# EAGLE design project_2_DDR (EAGLE 9.6.2)
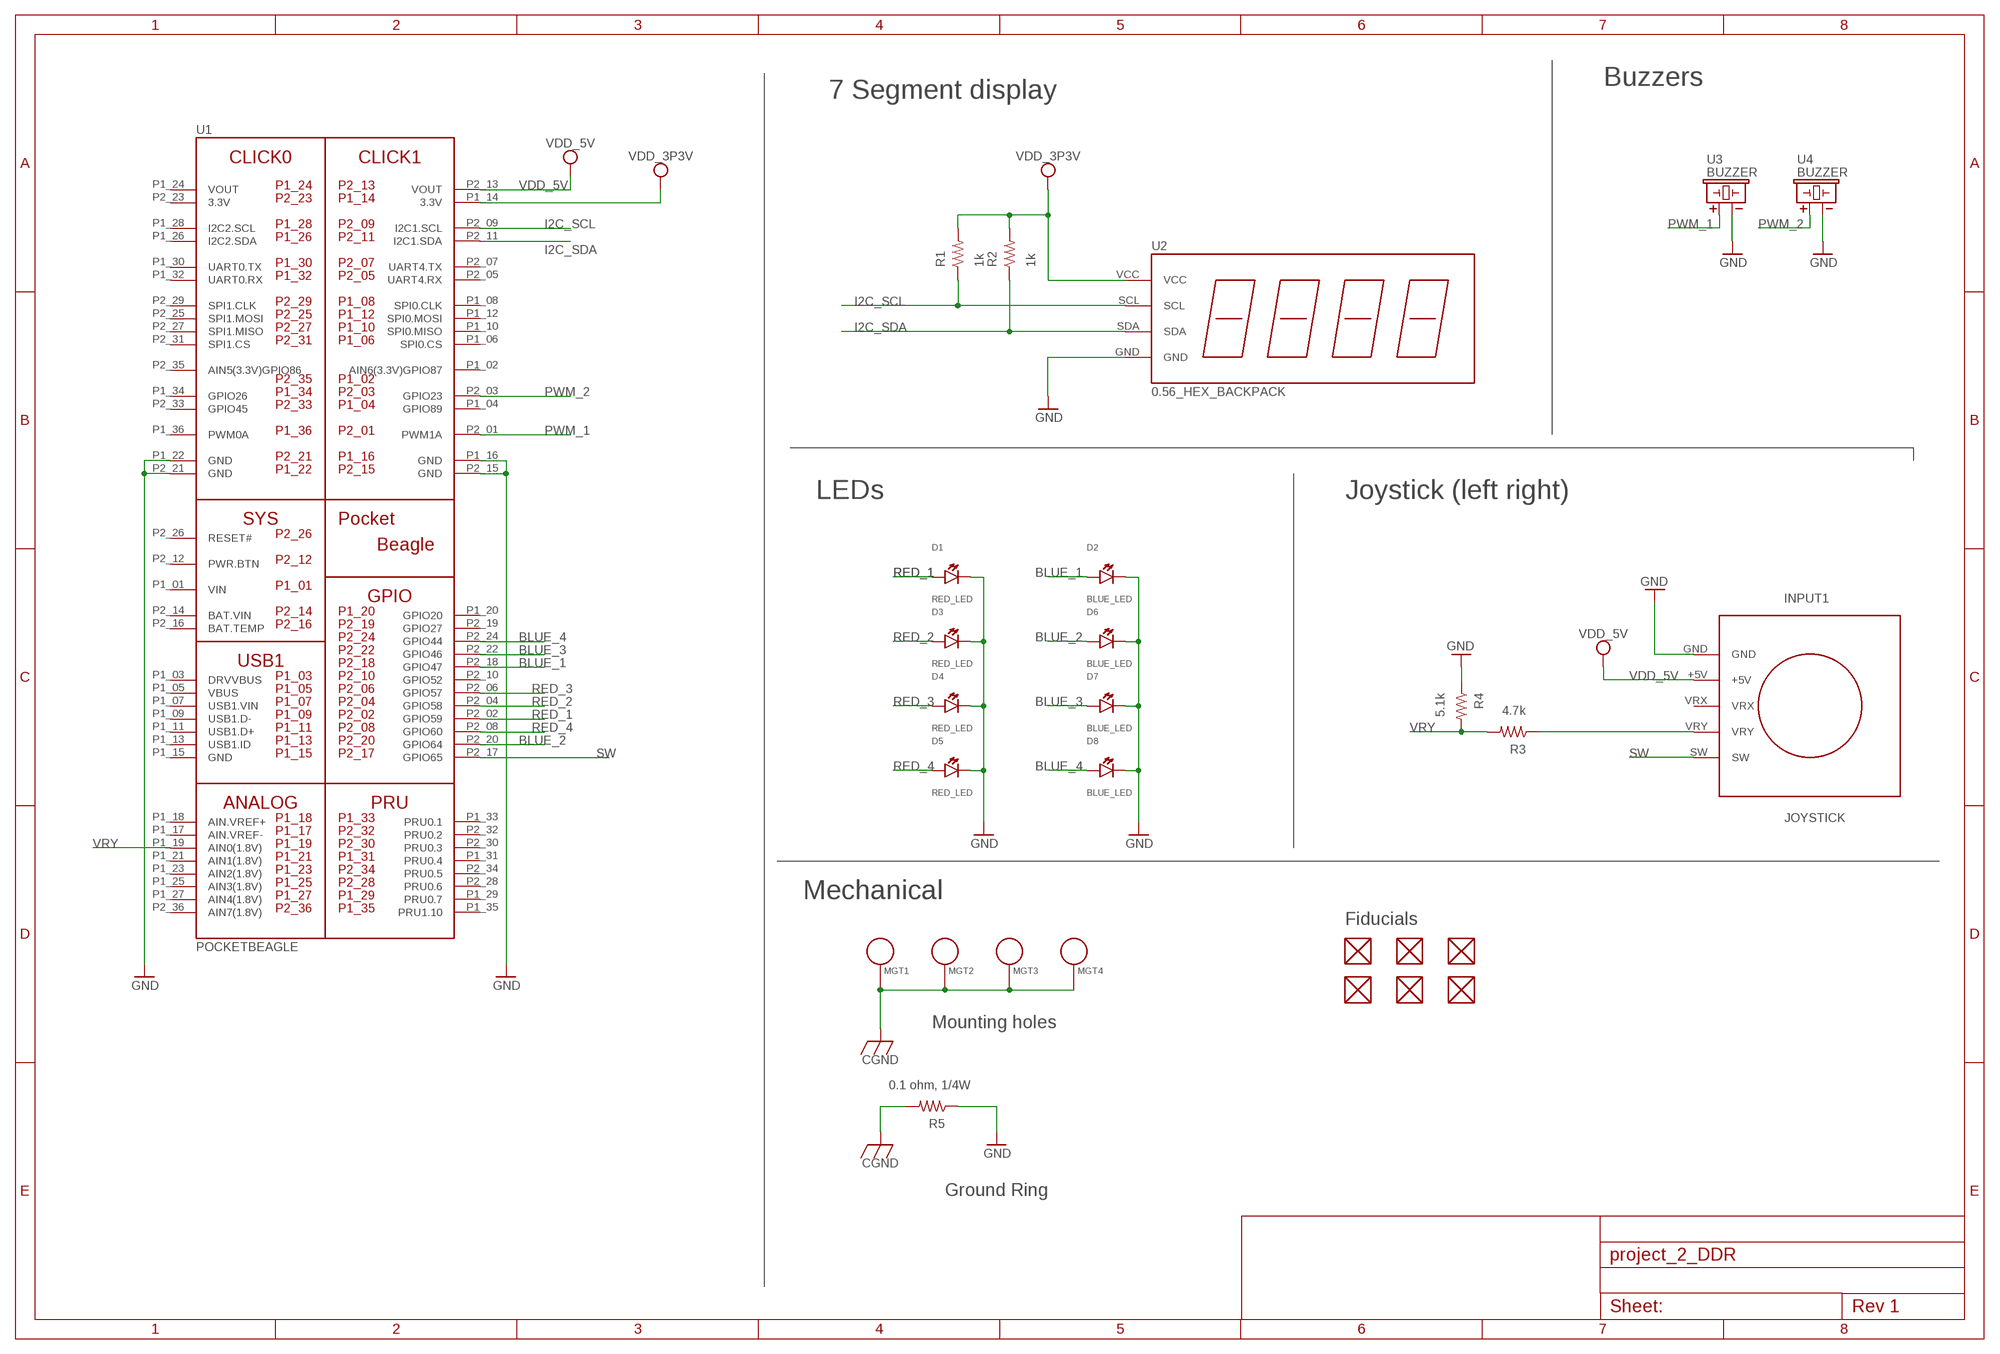
[diagram p0: schematic, sheet 1]

## Parts
D1  RED_LED  LED  [EIA-STD]
D2  BLUE_LED  LED  [EIA-STD]
D3  RED_LED  LED  [EIA-STD]
D4  RED_LED  LED  [EIA-STD]
D5  RED_LED  LED  [EIA-STD]
D6  BLUE_LED  LED  [EIA-STD]
D7  BLUE_LED  LED  [EIA-STD]
D8  BLUE_LED  LED  [EIA-STD]
FUD1  FIDUCIAL  [FIDUCIAL_40MIL]
FUD2  FIDUCIAL  [FIDUCIAL_40MIL]
FUD3  FIDUCIAL  [FIDUCIAL_40MIL]
FUD4  FIDUCIAL  [FIDUCIAL_40MIL]
FUD5  FIDUCIAL  [FIDUCIAL_40MIL]
FUD6  FIDUCIAL  [FIDUCIAL_40MIL]
INPUT1  JOYSTICK  [JOYSTICK]
MGT1  MOUNTING_HOLE  [MOUNTING_HOLE]
MGT2  MOUNTING_HOLE  [MOUNTING_HOLE]
MGT3  MOUNTING_HOLE  [MOUNTING_HOLE]
MGT4  MOUNTING_HOLE  [MOUNTING_HOLE]
R1  1k  R_R0603  [R0603]
R2  1k  R_R0603  [R0603]
R3  4.7k  R_R0603  [R0603]
R4  5.1k  R_R0603  [R0603]
R5  0.1 ohm, 1/4W  R_R0603  [R0603]
U1  POCKETBEAGLE  [POCKETBEAGLE]
U2  0.56_HEX_BACKPACK  [0.56_HEX_BACKPACK]
U3  BUZZER  [BUZZER_6.5MM]
U4  BUZZER  [BUZZER_6.5MM]

## Nets
BLUE_1: D2.ANODE U1.P2_18(GPIO47)
BLUE_2: D6.ANODE U1.P2_20(GPIO64)
BLUE_3: D7.ANODE U1.P2_22(GPIO46)
BLUE_4: D8.ANODE U1.P2_24(GPIO44)
CGND: MGT1.P$1 MGT2.P$1 MGT3.P$1 MGT4.P$1 R5.2
GND: D1.CATHODE D2.CATHODE D3.CATHODE D4.CATHODE D5.CATHODE D6.CATHODE D7.CATHODE D8.CATHODE INPUT1.GND R4.1 R5.1 U1.P1_16(GND) U1.P1_22(GND) U1.P2_15(GND) U1.P2_21(GND) U2.GND U3.- U4.-
I2C_SCL: R1.1 U1.P2_09(I2C1.SCL) U2.SCL
I2C_SDA: R2.1 U1.P2_11(I2C1.SDA) U2.SDA
N$1: INPUT1.VRY R3.1
PWM_1: U1.P2_01(PWM1A) U3.+
PWM_2: U1.P2_03(GPIO23) U4.+
RED_1: D1.ANODE U1.P2_02(GPIO59)
RED_2: D3.ANODE U1.P2_04(GPIO58)
RED_3: D4.ANODE U1.P2_06(GPIO57)
RED_4: D5.ANODE U1.P2_08(GPIO60)
SW: INPUT1.SW U1.P2_17(GPIO65)
VDD_3P3V: R1.2 R2.2 U1.P1_14(3.3V) U2.VCC
VDD_5V: INPUT1.+5V U1.P2_13(VOUT)
VRY: R3.2 R4.2 U1.P1_19(AIN0(1.8V))
Unconnected: FUD1.P$1 FUD2.P$1 FUD3.P$1 FUD4.P$1 FUD5.P$1 FUD6.P$1 INPUT1.VRX U1.P1_02(AIN6(3.3V)GPIO87) U1.P1_03(DRVVBUS) U1.P1_04(GPIO89) U1.P1_05(VBUS) U1.P1_06(SPI0.CS) U1.P1_07(USB1.VIN) U1.P1_08(SPI0.CLK) U1.P1_09(USB1.D-) U1.P1_10(SPI0.MISO) U1.P1_11(USB1.D+) U1.P1_12(SPI0.MOSI) U1.P1_13(USB1.ID) U1.P1_15(GND) U1.P1_17(AIN.VREF-) U1.P1_18(AIN.VREF+) U1.P1_20(GPIO20) U1.P1_21(AIN1(1.8V)) U1.P1_23(AIN2(1.8V)) U1.P1_25(AIN3(1.8V)) U1.P1_26(I2C2.SDA) U1.P1_27(AIN4(1.8V)) U1.P1_28(I2C2.SCL) U1.P1_29(PRU0.7) U1.P1_30(UART0.TX) U1.P1_31(PRU0.4) U1.P1_32(UART0.RX) U1.P1_33(PRU0.1) U1.P1_34(GPIO26) U1.P1_35(PRU1.10) U1.P1_36(PWM0A) U1.P2_05(UART4.RX) U1.P2_07(UART4.TX) U1.P2_10(GPIO52) U1.P2_12(PWR.BTN) U1.P2_16(BAT.TEMP) U1.P2_19(GPIO27) U1.P2_25(SPI1.MOSI) U1.P2_26(RESET#) U1.P2_27(SPI1.MISO) U1.P2_28(PRU0.6) U1.P2_29(SPI1.CLK) U1.P2_30(PRU0.3) U1.P2_31(SPI1.CS) U1.P2_32(PRU0.2) U1.P2_33(GPIO45) U1.P2_34(PRU0.5) U1.P2_35(AIN5(3.3V)GPIO86) U1.P2_36(AIN7(1.8V))

## Notes on the sheet
- Buzzers
- 7 Segment display
- LEDs | Joystick (left right)
- Mechanical
- Fiducials
- Mounting holes
- Ground Ring

## Power pins joined to a net without a drawn wire
3.3V: U1.P2_23(3.3V)
BAT.VIN: U1.P2_14(BAT.VIN)
VIN: U1.P1_01(VIN)
VOUT: U1.P1_24(VOUT)

## Library data of the parts
D1-D8 = combo_lock:LED: EIA-STD LED, LTST-C191TBKT
FUD1-FUD6 = combo_lock:FIDUCIAL
INPUT1 = MISC:JOYSTICK
MGT1-MGT4 = combo_lock:MOUNTING_HOLE: Chassis Mounting Hole w/GND connection ability
R1-R5 = combo_lock:R_: RESISTOR, American symbol
U1 = combo_lock:POCKETBEAGLE
U2 = combo_lock:0.56_HEX_BACKPACK: 0.56" LED HEX Backback - Adafruit HT16K33 - https://www.adafruit.com/product/878 - https://www.adafruit.com/product/879 - https://www.adafruit.com/product/880 - https://www.adafruit.com/product/881 - https://www.adafruit.com/product/1002
U3 U4 = combo_lock:BUZZER: CEM-1203 Buzzer

## Board
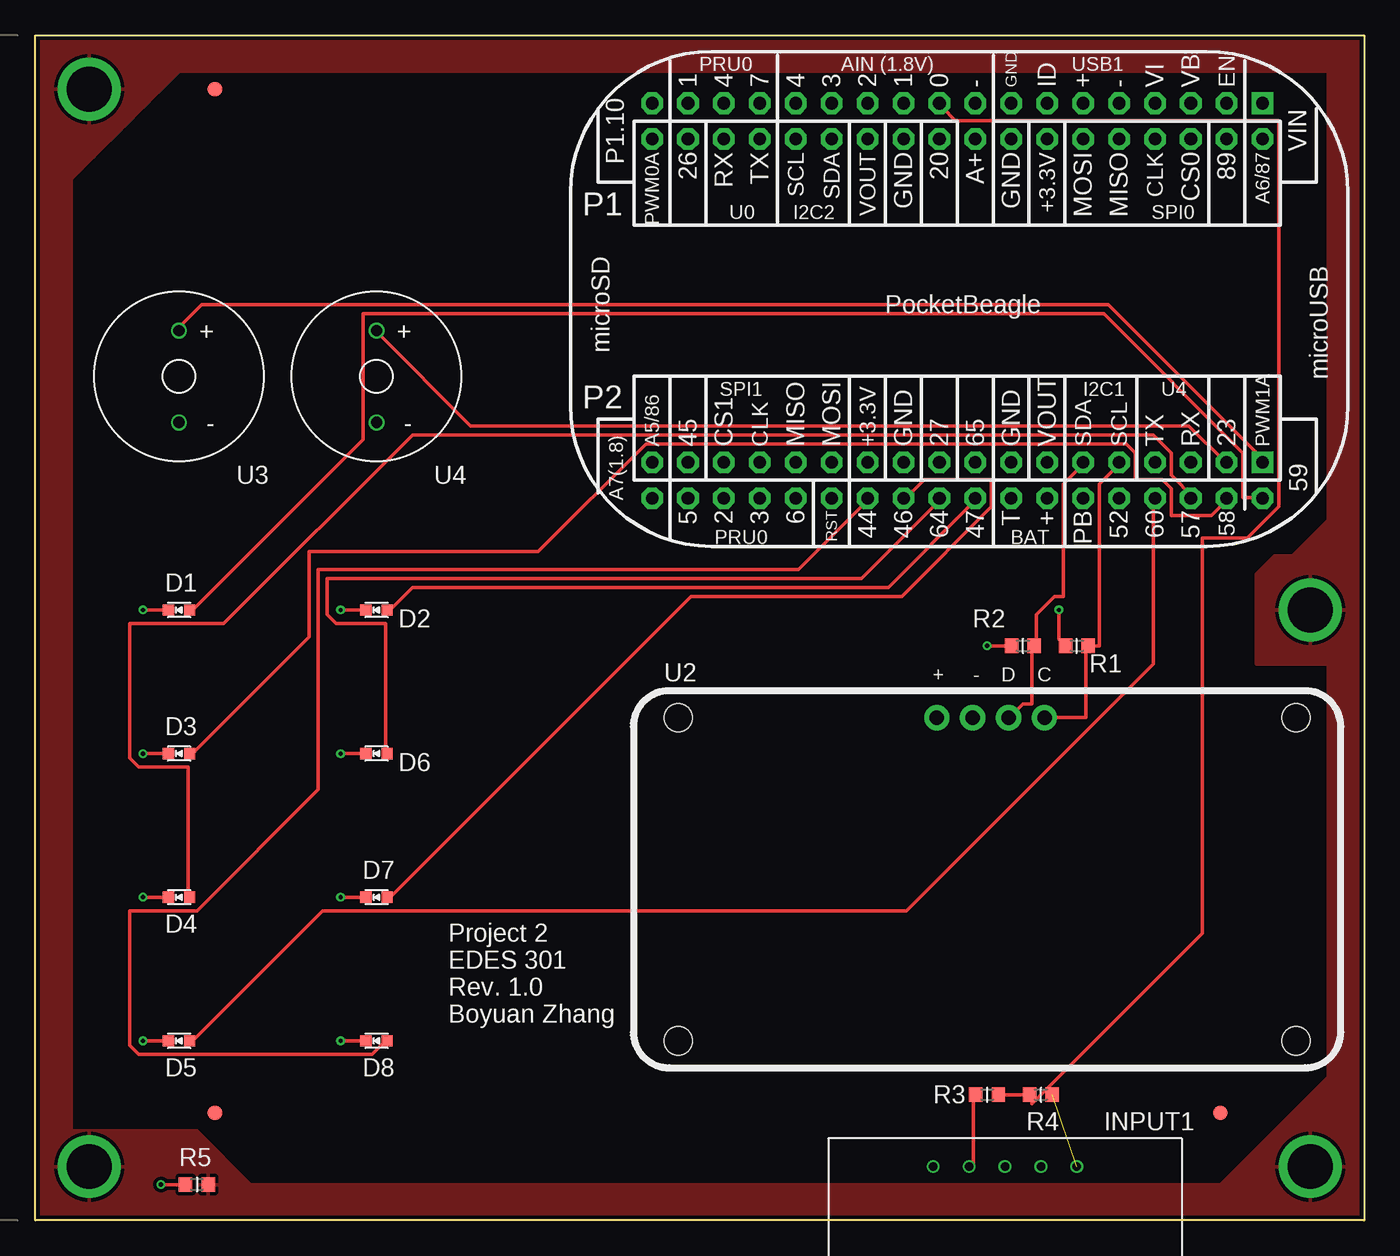
[diagram p1: board, top side]
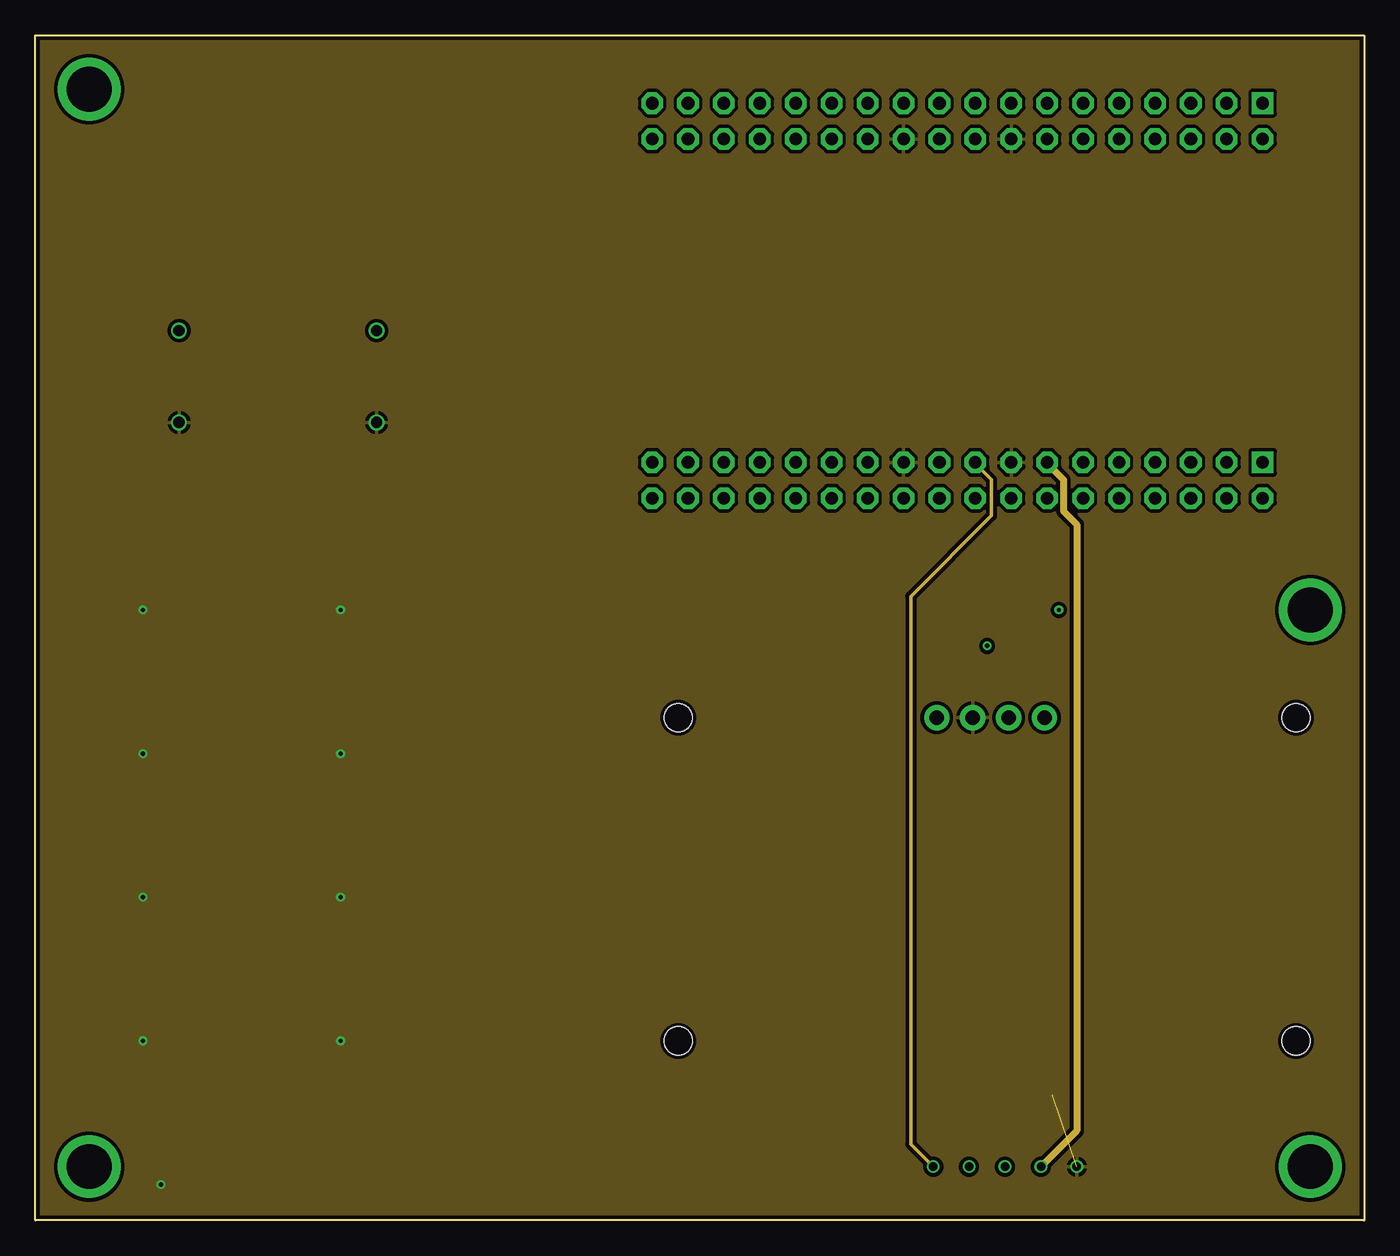
[diagram p2: board, inner layer Route2]
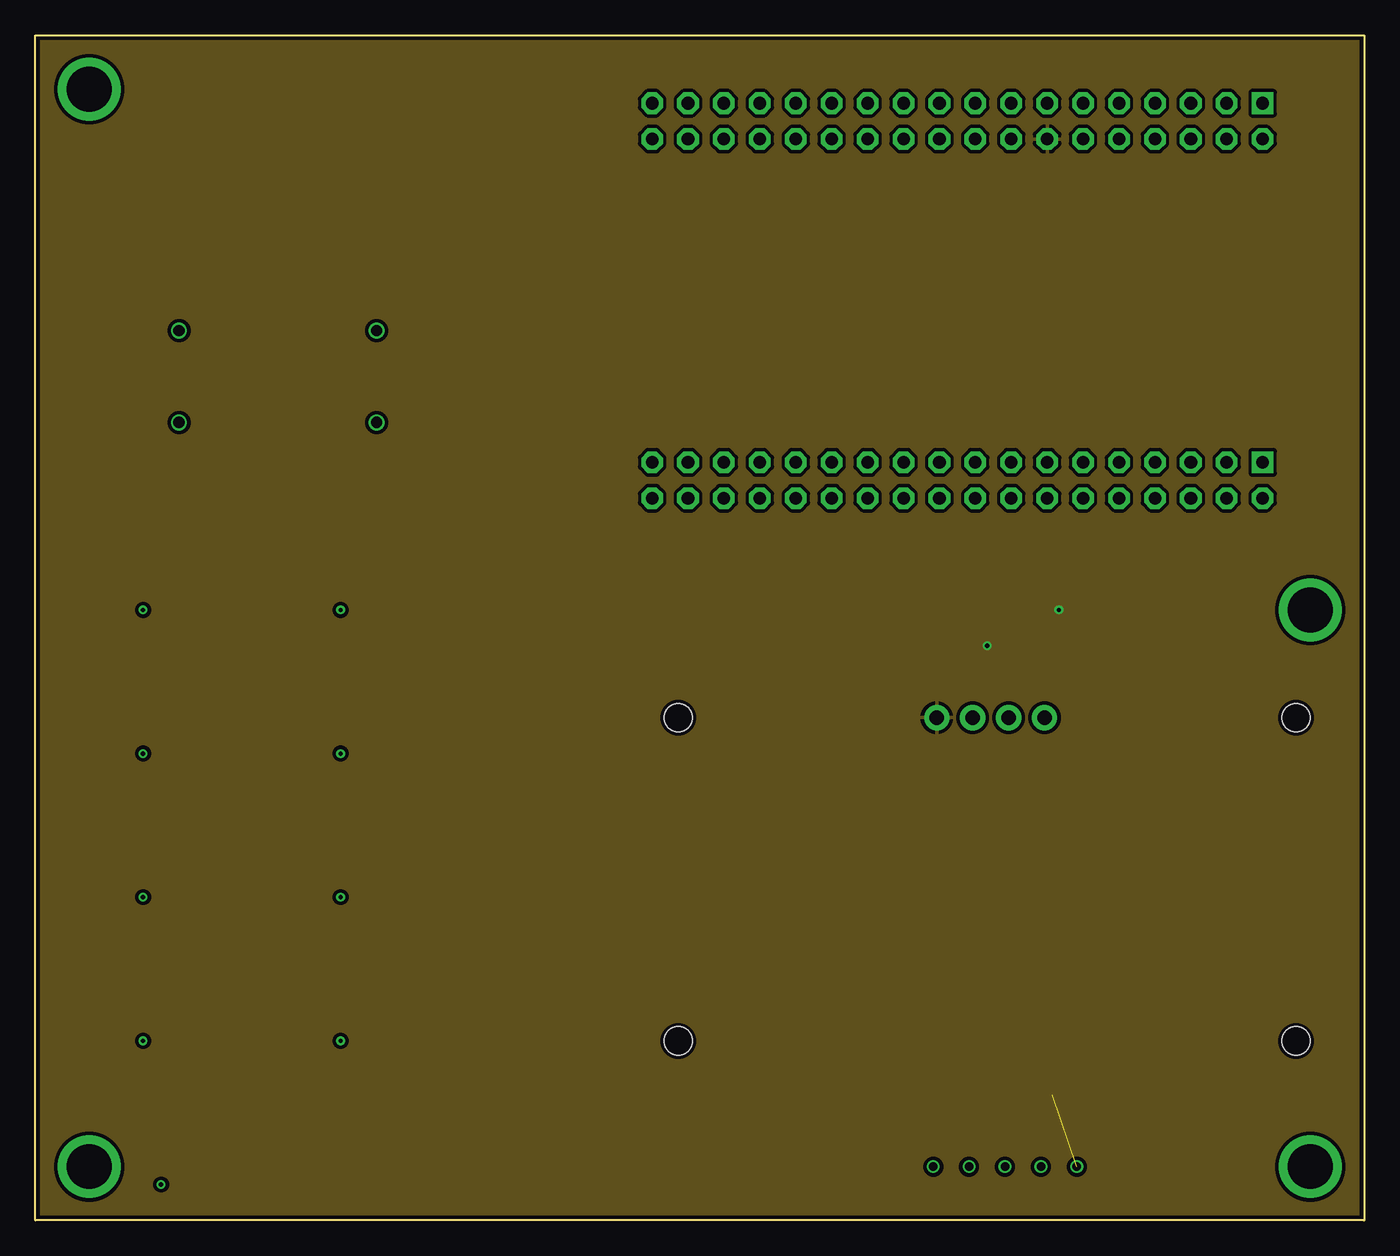
[diagram p3: board, inner layer Route15]
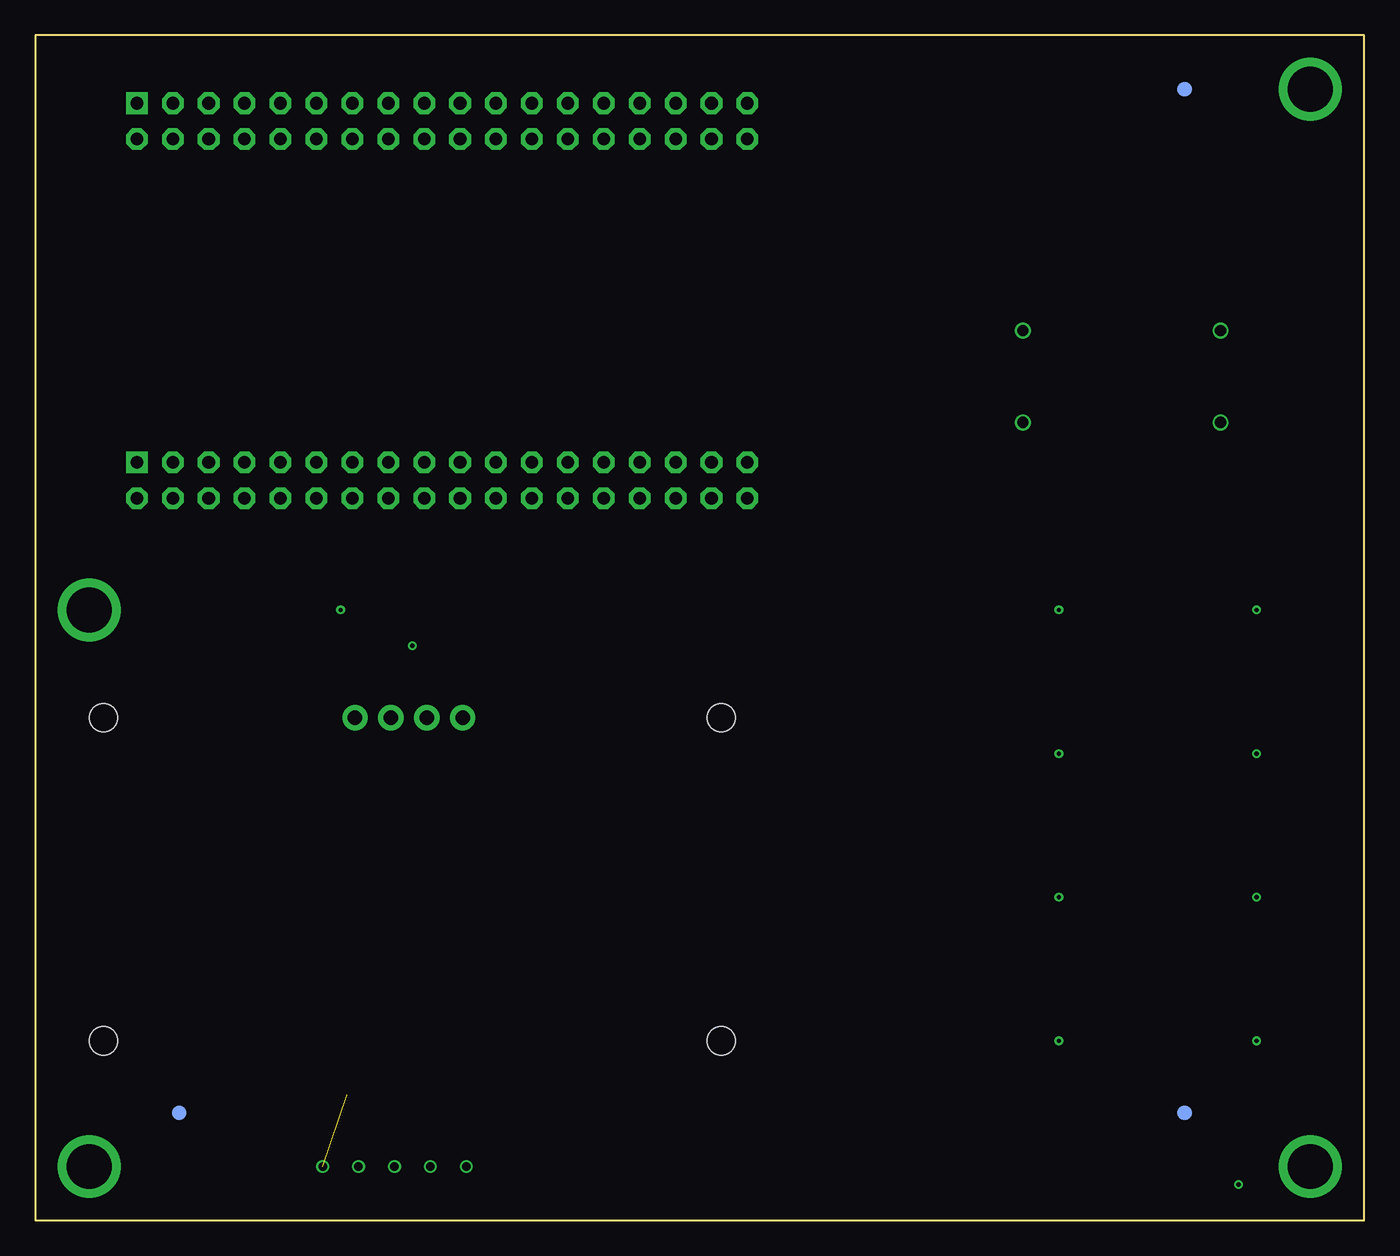
[diagram p4: board, bottom side, seen from below]

Size 93.98 x 83.82 mm. Coordinates in mm from the lower left corner, seen from the top.
Outline: 0,0 0,83.82 93.98,83.82 93.98,0 0,0
Copper layers (1*2*15*16): Top 0.035mm / dielectric 0.23mm / Route2 0.035mm / dielectric 0.93mm / Route15 0.035mm / dielectric 0.23mm / Bottom 0.035mm
Design rules "EDES301_4lyr": minimum track width 10mil, minimum drill 12mil, track to track 10mil, track to pad 10mil, pad to pad 10mil, via to via 10mil, smd to smd 10mil, copper to edge 10mil, drill to drill 12mil, minimum pad ring 6mil, minimum via ring 6mil, stop-mask expansion 3mil, vias tented up to drill 25mil, thermal gap 10mil

### Footprints (pad centres in the part's own frame; a part is rotated, then mirrored left to right if it is on the bottom)
EIA-STD = smd 0.8 x 0.8: ANODE -0.75,0; CATHODE 0.75,0
FIDUCIAL_40MIL = smd 1.016 x 1.016: P$1 0,0
JOYSTICK = drill 0.6: +5V -16.51,2.54; GND -16.51,5.08; SW -16.51,-5.08; VRX -16.51,0; VRY -16.51,-2.54
MOUNTING_HOLE = drill 3.175 pad 4.445: P$1 0,0
R0603 = smd 0.95 x 1.031: 1 -0.8,0; 2 0.8,0
POCKETBEAGLE = drill 0.889 pad 1.524 square: P1_01 5.91,3.53; P2_01 5.91,28.93 | drill 0.889 pad 1.524 octagon: P1_02 5.91,6.07; P1_03 8.45,3.53; P1_04 8.45,6.07; P1_05 10.99,3.53; P1_06 10.99,6.07; P1_07 13.53,3.53; P1_08 13.53,6.07; P1_09 16.07,3.53; P1_10 16.07,6.07; P1_11 18.61,3.53; P1_12 18.61,6.07; P1_13 21.15,3.53; P1_14 21.15,6.07; P1_15 23.69,3.53; P1_16 23.69,6.07; P1_17 26.23,3.53; P1_18 26.23,6.07; P1_19 28.77,3.53; P1_20 28.77,6.07; P1_21 31.31,3.53; P1_22 31.31,6.07; P1_23 33.85,3.53; P1_24 33.85,6.07; P1_25 36.39,3.53; P1_26 36.39,6.07; P1_27 38.93,3.53; P1_28 38.93,6.07; P1_29 41.47,3.53; P1_30 41.47,6.07; P1_31 44.01,3.53; P1_32 44.01,6.07; P1_33 46.55,3.53; P1_34 46.55,6.07; P1_35 49.09,3.53; P1_36 49.09,6.07; P2_02 5.91,31.47; P2_03 8.45,28.93; P2_04 8.45,31.47; P2_05 10.99,28.93; P2_06 10.99,31.47; P2_07 13.53,28.93; P2_08 13.53,31.47; P2_09 16.07,28.93; P2_10 16.07,31.47; P2_11 18.61,28.93; P2_12 18.61,31.47; P2_13 21.15,28.93; P2_14 21.15,31.47; P2_15 23.69,28.93; P2_16 23.69,31.47; P2_17 26.23,28.93; P2_18 26.23,31.47; P2_19 28.77,28.93; P2_20 28.77,31.47; P2_21 31.31,28.93; P2_22 31.31,31.47; P2_23 33.85,28.93; P2_24 33.85,31.47; P2_25 36.39,28.93; P2_26 36.39,31.47; P2_27 38.93,28.93; P2_28 38.93,31.47; P2_29 41.47,28.93; P2_30 41.47,31.47; P2_31 44.01,28.93; P2_32 44.01,31.47; P2_33 46.55,28.93; P2_34 46.55,31.47; P2_35 49.09,28.93; P2_36 49.09,31.47
0.56_HEX_BACKPACK = drill 1.016 pad 1.778: GND -1.016,11.43; SCL 4.064,11.43; SDA 1.524,11.43; VCC -3.556,11.43 | hole 2: -21.844,-11.43; 21.844,-11.43; -21.844,11.43; 21.844,11.43
BUZZER_6.5MM = drill 0.8: + 0,-3.25; - 0,3.25

### Placement (x,y rotation side)
D1  10.16,43.18 180 top
D2  24.13,43.18 180 top
D3  10.16,33.02 180 top
D4  10.16,22.86 180 top
D5  10.16,12.7 180 top
D6  24.13,33.02 180 top
D7  24.13,22.86 180 top
D8  24.13,12.7 180 top
FUD1  12.7,7.62 0 top
FUD2  83.82,7.62 0 top
FUD3  12.7,80.01 0 top
FUD4  12.7,7.62 180 bottom
FUD5  83.82,7.62 0 bottom
FUD6  12.7,80.01 0 bottom
INPUT1  68.58,-12.7 270 top
MGT1  90.17,43.18 0 top
MGT2  3.81,3.81 0 top
MGT3  90.17,3.81 0 top
MGT4  3.81,80.01 0 top
R1  73.66,40.64 180 top
R2  69.85,40.64 180 top
R3  67.31,8.89 0 top
R4  71.12,8.89 180 top
R5  11.43,2.54 0 top
U1  92.71,82.55 180 top
U2  67.31,24.13 0 top
U3  10.16,59.69 180 top
U4  24.13,59.69 180 top

### Tracks (layer width: path | path; a pad name or v marks a point on that pad's centre or on a via)
BLUE_1
  Top 0.254: D2.ANODE 25.08,43.18 26.67,44.77 60.33,44.77 66.36,50.8 U1.P2_18
BLUE_2
  Top 0.254: D6.ANODE 24.77,33.02 24.77,42.23 21.27,42.23 20.64,42.86 20.64,45.4 58.42,45.4 63.82,50.8 U1.P2_20
BLUE_3
  Top 0.254: D7.ANODE 25.08,22.86 46.35,44.13 61.28,44.13 67.63,50.48 67.63,52.39 62.87,52.39 61.59,51.12 U1.P2_22
BLUE_4
  Top 0.254: D8.ANODE 24.77,12.7 23.81,11.75 7.3,11.75 6.67,12.38 6.67,21.91 11.43,21.91 20,30.48 20,46.04 53.98,46.04 58.74,50.8 U1.P2_24
CGND
  Top 0.254: 12.06,2.54 R5.2 12.38,2.54
  pour Top: 10.16,81.28 2.54,73.66 -1.27,73.66 -1.27,86.36 97.79,86.36 97.79,39.37 86.36,39.37 86.36,45.72 87.63,46.99 88.9,46.99 91.44,49.53 91.44,81.28
  pour Top: -1.27,73.66 -1.27,-2.54 97.79,-2.54 97.79,39.37 91.44,39.37 91.44,10.16 83.82,2.54 15.24,2.54 11.43,6.35 2.54,6.35 2.54,73.66
GND  (via drill 0.3 pad 0.61)  (1 unrouted)
  Top 0.254: D5.CATHODE v7.62,12.7 | D4.CATHODE v7.62,22.86 | D3.CATHODE v7.62,33.02 | D1.CATHODE v7.62,43.18 | D2.CATHODE v21.59,43.18 | D6.CATHODE v21.59,33.02 | D7.CATHODE v21.59,22.86 | D8.CATHODE v21.59,12.7 | R5.1 v8.89,2.54 | R4.1 71.75,9.05
  pour Route2: -5.08,-5.08 -5.08,104.14 132.08,104.14 132.08,-5.08
I2C_SCL
  Top 0.254: U2.SCL 74.3,35.56 74.3,40.64 R1.1 75.25,40.64 75.25,52.07 76.52,53.34 U1.P2_09
I2C_SDA
  Top 0.254: U2.SDA 68.9,35.56 69.85,36.51 70.48,36.51 70.48,40.64 R2.1 70.8,40.64 70.8,42.86 72.07,44.13 72.71,44.13 72.71,52.07 73.98,53.34 U1.P2_11
N$1
  Top 0.254: INPUT1.VRY 66.36,3.81 66.36,8.89 R3.1
PWM_1
  Top 0.254: U3.+ 10.16,63.18 11.75,64.77 75.88,64.77 87,53.66 U1.P2_01
PWM_2
  Top 0.254: U4.+ 24.13,62.87 30.8,56.2 81.6,56.2 84.14,53.66 U1.P2_03
RED_1
  Top 0.254: D1.ANODE 11.11,43.18 23.18,55.24 23.18,64.14 75.56,64.14 85.41,54.29 85.41,51.12 86.68,51.12 U1.P2_02
RED_2
  Top 0.254: D3.ANODE 11.11,33.02 19.37,41.27 19.37,47.31 35.56,47.31 43.18,54.93 77.15,54.93 77.79,54.29 77.79,52.39 79.69,52.39 80.33,51.75 80.33,49.85 83.19,49.85 84.14,50.8 U1.P2_04
RED_3
  Top 0.254: D4.ANODE 10.79,22.86 10.79,32.07 7.3,32.07 6.67,32.7 6.67,42.23 13.34,42.23 26.67,55.56 79.06,55.56 80.33,54.29 80.33,52.7 81.92,51.12 U1.P2_06
RED_4
  Top 0.254: D5.ANODE 11.11,12.7 20.32,21.91 61.59,21.91 79.06,39.37 79.06,50.8 U1.P2_08
SW
  Route2 0.254: INPUT1.SW 61.91,5.4 61.91,44.13 67.63,49.85 67.63,52.39 66.67,53.34 U1.P2_17
VDD_3P3V  (via drill 0.3 pad 0.61)
  Top 0.254: R2.2 v67.31,40.64 | R1.2 72.39,41.11 v72.39,43.18
  pour Route15: -7.62,-7.62 -7.62,106.68 134.62,106.68 134.62,-7.62
VDD_5V
  Route2 0.508: INPUT1.+5V 73.66,6.35 73.66,49.21 72.71,50.16 72.71,52.39 71.75,53.34 U1.P2_13
VRY
  Top 0.254: R3.2 R4.2 70.48,8.89 70.48,8.26 82.55,20.32 82.55,48.26 85.72,48.26 87.95,50.48 87.95,77.79 65.09,77.79 64.14,78.74 U1.P1_19

### Text on the board
tPlace: Project 2 / EDES 301 / Rev. 1.0 / Boyuan Zhang